# EAGLE schematic midi2cv.2.0 (EAGLE 7.5.0)
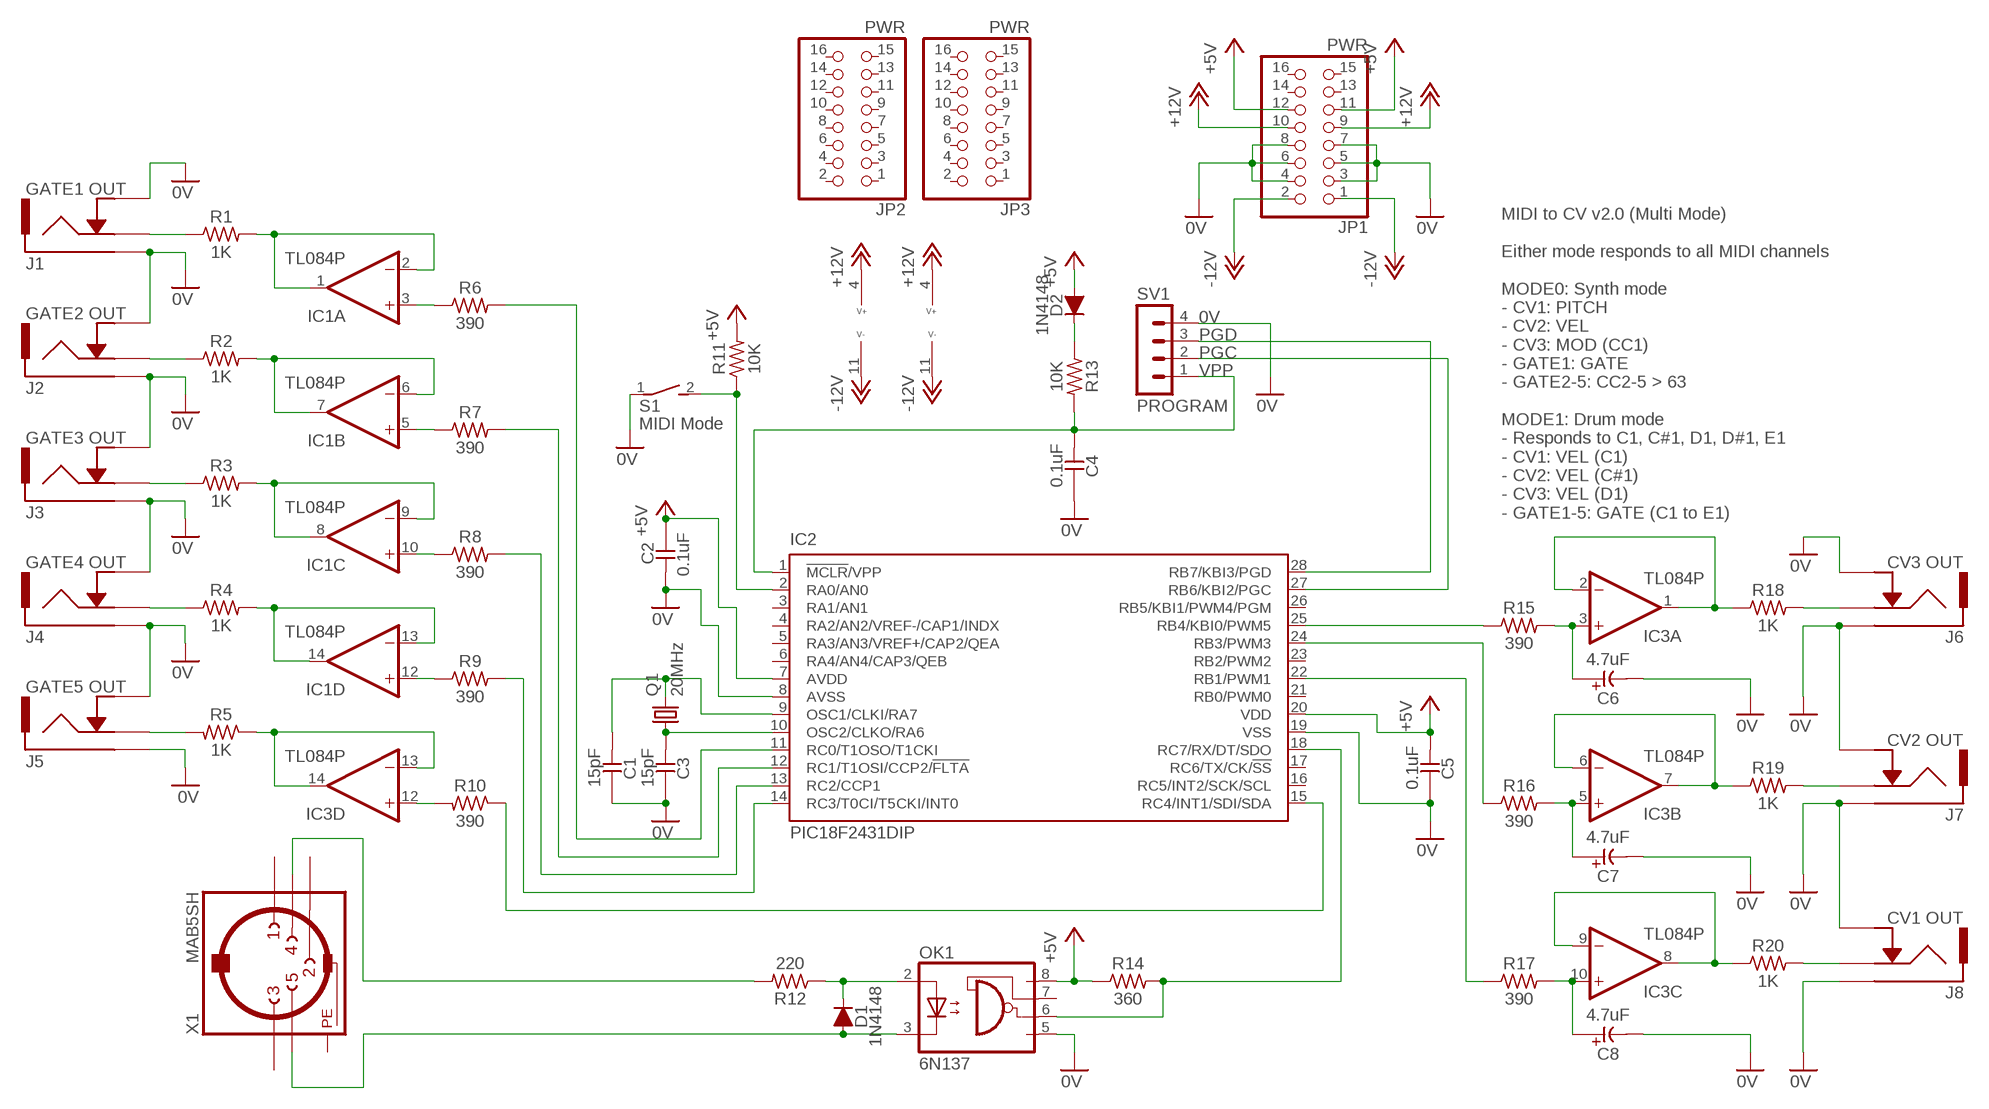
[diagram p0: schematic, sheet 1]

## Parts
C1  15pF  CC-US025-024X044  [C025-024X044]
C2  0.1uF  CC-US025-024X044  [C025-024X044]
C3  15pF  CC-US025-024X044  [C025-024X044]
C4  0.1uF  CC-US025-024X044  [C025-024X044]
C5  0.1uF  CC-US025-024X044  [C025-024X044]
C6  4.7uF  CE-USE2-5  [E2-5]
C7  4.7uF  CE-USE2-5  [E2-5]
C8  4.7uF  CE-USE2-5  [E2-5]
D1  1N4148  [DO35-7]
D2  1N4148  [DO35-7]
IC1  TL084P  [DIL14]
IC2  PIC18F2431DIP  [DIL28-3]
IC3  TL084P  [DIL14]
J1  GATE1 OUT  ACJM-MV35-2S  [ACJM-MV35-2S]
J2  GATE2 OUT  ACJM-MV35-2S  [ACJM-MV35-2S]
J3  GATE3 OUT  ACJM-MV35-2S  [ACJM-MV35-2S]
J4  GATE4 OUT  ACJM-MV35-2S  [ACJM-MV35-2S]
J5  GATE5 OUT  ACJM-MV35-2S  [ACJM-MV35-2S]
J6  CV3 OUT  ACJM-MV35-2S  [ACJM-MV35-2S]
J7  CV2 OUT  ACJM-MV35-2S  [ACJM-MV35-2S]
J8  CV1 OUT  ACJM-MV35-2S  [ACJM-MV35-2S]
JP1  PWR  PINHD-2X8  [2X08]
JP2  PWR  PINHD-2X8  [2X08]
JP3  PWR  PINHD-2X8  [2X08]
OK1  6N137  [DIL08]
Q1  20MHz  CRYSTALHC49S  [HC49/S]
R1  1K  R0309/10  [0309/10]
R2  1K  R0309/10  [0309/10]
R3  1K  R0309/10  [0309/10]
R4  1K  R0309/10  [0309/10]
R5  1K  R0309/10  [0309/10]
R6  390  R0309/10  [0309/10]
R7  390  R0309/10  [0309/10]
R8  390  R0309/10  [0309/10]
R9  390  R0309/10  [0309/10]
R10  390  R0309/10  [0309/10]
R11  10K  R0309/10  [0309/10]
R12  220  R0309/10  [0309/10]
R13  10K  R0309/10  [0309/10]
R14  360  R0309/10  [0309/10]
R15  390  R0309/10  [0309/10]
R16  390  R0309/10  [0309/10]
R17  390  R0309/10  [0309/10]
R18  1K  R0309/10  [0309/10]
R19  1K  R0309/10  [0309/10]
R20  1K  R0309/10  [0309/10]
S1  MIDI Mode  DS01E  [DS-01]
SV1  PROGRAM  MA04-1  [MA04-1]
X1  MAB5SH  [MAB5SH]

## Nets
0V: C1.1 C2.2 C3.1 C4.1 C5.1 C6.- C7.- C8.- IC2.8(AVSS) IC2.19(VSS) J1.P$1 J1.P$3 J2.P$1 J2.P$3 J3.P$1 J3.P$3 J4.P$1 J4.P$3 J5.P$1 J5.P$3 J6.P$1 J6.P$3 J7.P$1 J7.P$3 J8.P$1 J8.P$3 JP1.3 JP1.4 JP1.5 JP1.6 JP1.7 JP1.8 OK1.5(GND) S1.1 SV1.4
+5V: C2.1 C5.2 D2.A IC2.7(AVDD) IC2.20(VDD) JP1.11 JP1.12 OK1.8(VCC) R11.2 R14.1
+12V: IC1.4(P:V+) IC3.4(P:V+) JP1.9 JP1.10
-12V: IC1.11(P:V-) IC3.11(P:V-) JP1.1 JP1.2
N$1: D2.C R13.1
N$2: IC3.1(A:OUT) IC3.2(A:-IN) R18.1
N$3: IC3.6(B:-IN) IC3.7(B:OUT) R19.1
N$4: IC3.8(C:OUT) IC3.9(C:-IN) R20.1
N$5: IC1.5(B:+IN) R7.1
N$6: C3.2 IC2.10(OSC2/CLKO/RA6) Q1.1
N$7: IC3.13(D:-IN) IC3.14(D:OUT) R5.1
N$8: C6.+ IC3.3(A:+IN) R15.2
N$9: R12.2 X1.4
N$10: D1.A OK1.3(C) X1.5
N$11: D1.C OK1.2(A) R12.1
N$12: C7.+ IC3.5(B:+IN) R16.2
N$13: IC2.18(RC7/RX/DT/SDO) OK1.6(VO) R14.2
N$14: C8.+ IC3.10(C:+IN) R17.2
N$15: IC3.12(D:+IN) R10.2
N$16: IC2.25(RB4/KBI0/PWM5) R15.1
N$17: IC2.24(RB3/PWM3) R16.1
N$18: IC2.22(RB1/PWM1) R17.1
N$19: IC2.15(RC4/INT1/SDI/SDA) R10.1
N$20: IC2.2(RA0/AN0) R11.1 S1.2
N$21: J1.P$2 R1.1
N$22: J2.P$2 R2.1
N$23: J3.P$2 R3.1
N$24: J4.P$2 R4.1
N$25: J5.P$2 R5.2
N$26: IC2.11(RC0/T1OSO/T1CKI) R6.2
N$27: C1.2 IC2.9(OSC1/CLKI/RA7) Q1.2
N$28: IC2.12(RC1/T1OSI/CCP2/!FLTA) R7.2
N$29: IC2.13(RC2/CCP1) R8.2
N$30: IC2.14(RC3/T0CI/T5CKI/INT0) R9.2
N$31: IC1.13(D:-IN) IC1.14(D:OUT) R4.2
N$32: IC1.12(D:+IN) R9.1
N$33: IC1.10(C:+IN) R8.1
N$34: IC1.3(A:+IN) R6.1
N$35: IC1.8(C:OUT) IC1.9(C:-IN) R3.2
N$36: IC1.6(B:-IN) IC1.7(B:OUT) R2.2
N$37: IC1.1(A:OUT) IC1.2(A:-IN) R1.2
N$44: J6.P$2 R18.2
N$45: J7.P$2 R19.2
N$46: J8.P$2 R20.2
PGC: IC2.27(RB6/KBI2/PGC) SV1.2
PGD: IC2.28(RB7/KBI3/PGD) SV1.3
VPP: C4.2 IC2.1(!MCLR!/VPP) R13.2 SV1.1
Unconnected: IC2.3(RA1/AN1) IC2.4(RA2/AN2/VREF-/CAP1/INDX) IC2.5(RA3/AN3/VREF+/CAP2/QEA) IC2.6(RA4/AN4/CAP3/QEB) IC2.16(RC5/INT2/SCK/SCL) IC2.17(RC6/TX/CK/!SS) IC2.21(RB0/PWM0) IC2.23(RB2/PWM2) IC2.26(RB5/KBI1/PWM4/PGM) JP1.13 JP1.14 JP1.15 JP1.16 JP2.1 JP2.2 JP2.3 JP2.4 JP2.5 JP2.6 JP2.7 JP2.8 JP2.9 JP2.10 JP2.11 JP2.12 JP2.13 JP2.14 JP2.15 JP2.16 JP3.1 JP3.2 JP3.3 JP3.4 JP3.5 JP3.6 JP3.7 JP3.8 JP3.9 JP3.10 JP3.11 JP3.12 JP3.13 JP3.14 JP3.15 JP3.16 OK1.7(VE) X1.1 X1.2 X1.3

## Notes on the sheet
- MIDI to CV v2.0 (Multi Mode)
  
  Either mode responds to all MIDI channels
  
  MODE0: Synth mode 
  - CV1: PITCH
  - CV2: VEL
  - CV3: MOD (CC1)
  - GATE1: GATE
  - GATE2-5: CC2-5 > 63
  
  MODE1: Drum mode
  - Responds to C1, C#1, D1, D#1, E1
  - CV1: VEL (C1)
  - CV2: VEL (C#1)
  - CV3: VEL (D1)
  - GATE1-5: GATE (C1 to E1)

## Power pins joined to a net without a drawn wire
PE: X1.PE X1.PE@(PE)

## Library data of the parts
C1-C5 = _common:CC-US: CAPACITOR, US symbol
C6-C8 = _common:CE-US: ELECTROLYTIC CAPACITOR, US symbol
D1 D2 = _common:1N4148: DIODE high speed (Philips)
IC1 IC3 = _common:TL084: OP AMP
IC2 = _common:PIC18F2*31: USB Microcontrollers with nanoWatt Technology High-Performance, Enhanced Flash, 28-Pin, Source: http://ww1.microchip.com/downloads/en/devicedoc/39616d.pdf; MF: MICROCHIP; MPN: PIC18F2431-I/SP
J1-J8 = jacks:ACJM-MV35-2S: Amphenol 3.5mm Jack (Vertical) ACJM-MV35-2S http://ca.mouser.com/Search/ProductDetail.aspx?R=ACJM-MV35-2Svirtualkey52380000virtualkey523-ACJMMV352S
JP1-JP3 = pinhead:PINHD-2X8: PIN HEADER
OK1 = optocoupler:6N137: MOTOROLA OPTO COUPLER; MPN: 6N137; OC_FARNELL: 1328376; OC_NEWARK: 52M1895
Q1 = crystal:CRYSTAL: CRYSTAL; OC_FARNELL: 1667008; OC_NEWARK: unknown
R1-R20 = _common:R: RESISTOR, US symbol
S1 = switch-dil:DS01E: DIL/CODE SWITCH; OC_FARNELL: unknown; OC_NEWARK: unknown
SV1 = con-lstb:MA04-1: PIN HEADER; OC_FARNELL: unknown; OC_NEWARK: unknown
X1 = con-hirschmann:MAB5SH: Female CONNECTOR 5 pins 90 deg. with shield, horizontal (DIN 41524); OC_FARNELL: 809883; OC_NEWARK: unknown